# EAGLE design tile (EAGLE 6.1)
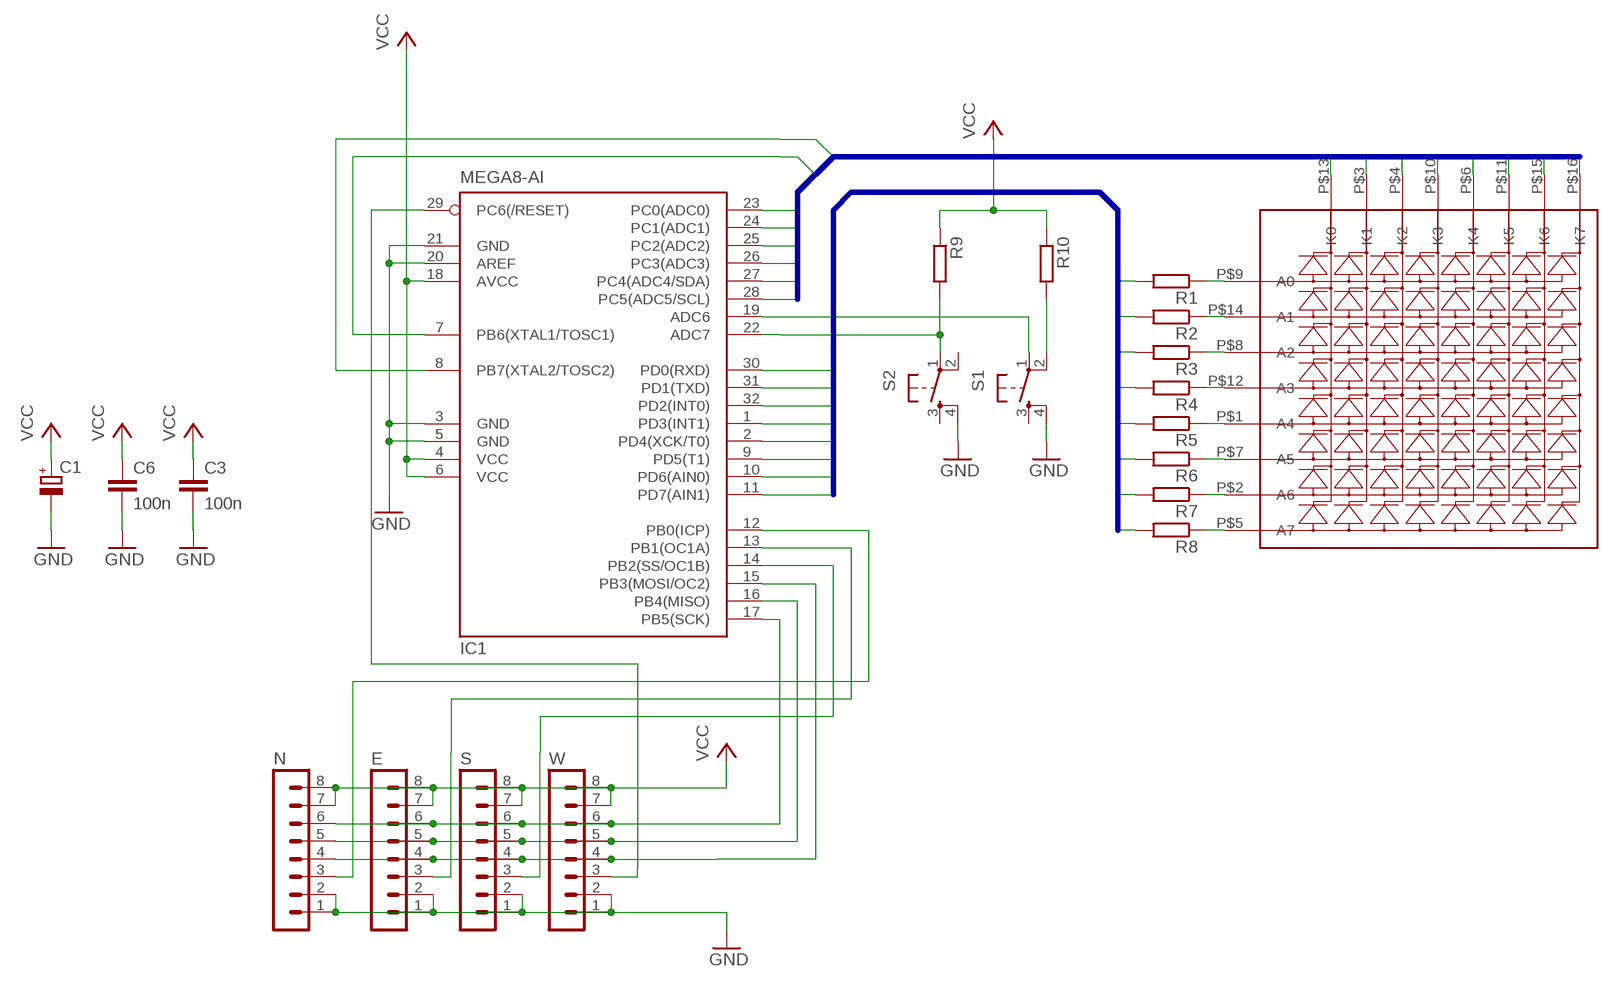
[diagram p0: schematic, sheet 1]

## Parts
C1  CPOL-EUB  [PANASONIC_B]
C3  100n  C-EUC0805  [C0805]
C6  100n  C-EUC0805  [C0805]
E  MA08-1  [MA08-1]
IC1  MEGA8-AI  [TQFP32-08]
N  MA08-1  [MA08-1]
R1  R-EU_M0805  [M0805]
R2  R-EU_M0805  [M0805]
R3  R-EU_M0805  [M0805]
R4  R-EU_M0805  [M0805]
R5  R-EU_M0805  [M0805]
R6  R-EU_M0805  [M0805]
R7  R-EU_M0805  [M0805]
R8  R-EU_M0805  [M0805]
R9  R-EU_M0805  [M0805]
R10  R-EU_M0805  [M0805]
S  MA08-1  [MA08-1]
S1  TAC_SWITCHSMD  [TACTILE_SWITCH_SMD]
S2  TAC_SWITCHSMD  [TACTILE_SWITCH_SMD]
U$1  LED-MATRIX  [LED-MATRIX]
W  MA08-1  [MA08-1]

## Nets
A0: IC1.30(PD0(RXD)) R1.2
A1: IC1.31(PD1(TXD)) R2.2
A2: IC1.32(PD2(INT0)) R3.2
A3: IC1.1(PD3(INT1)) R4.2
A4: IC1.2(PD4(XCK/T0)) R5.2
A5: IC1.9(PD5(T1)) R6.2
A6: IC1.10(PD6(AIN0)) R7.2
A7: IC1.11(PD7(AIN1)) R8.2
GND: C1.- C3.2 C6.2 E.1 E.2 IC1.3(GND) IC1.5(GND) IC1.20(AREF) IC1.21(GND) N.1 N.2 S1.4 S2.4 S.1 S.2 W.1 W.2
K0: IC1.23(PC0(ADC0)) U$1.P$13(K0)
K1: IC1.24(PC1(ADC1)) U$1.P$3(K1)
K2: IC1.25(PC2(ADC2)) U$1.P$4(K2)
K3: IC1.26(PC3(ADC3)) U$1.P$10(K3)
K4: IC1.27(PC4(ADC4/SDA)) U$1.P$6(K4)
K5: IC1.28(PC5(ADC5/SCL)) U$1.P$11(K5)
K6: IC1.7(PB6(XTAL1/TOSC1)) U$1.P$15(K6)
K7: IC1.8(PB7(XTAL2/TOSC2)) U$1.P$16(K7)
N$1: IC1.19(ADC6) S1.1
N$2: IC1.22(ADC7) R9.2 S2.1
N$3: E.4 IC1.15(PB3(MOSI/OC2)) N.4 S.4 W.4
N$4: R10.2 S1.2
N$6: IC1.14(PB2(SS/OC1B)) S.3
N$7: E.6 IC1.17(PB5(SCK)) N.6 S.6 W.6
N$8: IC1.29(PC6(/RESET)) W.3
N$9: E.5 IC1.16(PB4(MISO)) N.5 S.5 W.5
N$10: IC1.12(PB0(ICP)) N.3
N$11: E.3 IC1.13(PB1(OC1A))
NA0: R1.1 U$1.P$9(A0)
NA1: R2.1 U$1.P$14(A1)
NA2: R3.1 U$1.P$8(A2)
NA3: R4.1 U$1.P$12(A3)
NA4: R5.1 U$1.P$1(A4)
NA5: R6.1 U$1.P$7(A5)
NA6: R7.1 U$1.P$2(A6)
NA7: R8.1 U$1.P$5(A7)
VCC: C1.+ C3.1 C6.1 E.7 E.8 IC1.4(VCC) IC1.6(VCC) IC1.18(AVCC) N.7 N.8 R9.1 R10.1 S.7 S.8 W.7 W.8
Unconnected: S1.3 S2.2 S2.3

## Buses
K[0..7]
A[0..7]

## Library data of the parts
C1 = rcl:CPOL-EU: POLARIZED CAPACITOR, European symbol
C3 C6 = rcl:C-EU: CAPACITOR, European symbol
E N S W = tile:MA08-1: PIN HEADER
IC1 = atmel:MEGA8: MICROCONTROLLER 8 Kbytes FLASH, 1 kbytes SRAM, 512 bytes EEPROM, USART, 6-channel 10 bit ADC, 2-channel 8 bit ADC Pin compatible with Atmega48, ATMega88, ATMega168 Source: avr.lbr
R1-R10 = rcl:R-EU_: RESISTOR, European symbol
S1 S2 = SparkFun-Electromechanical:TAC_SWITCH: Momentary Switch Button commonly used for reset or general input. Spark Fun Electronics SKU : COM-00097 SMT- SWCH-08247; PROD_ID: SWCH-08247
U$1 = led-matrix:LED-MATRIX

## Board
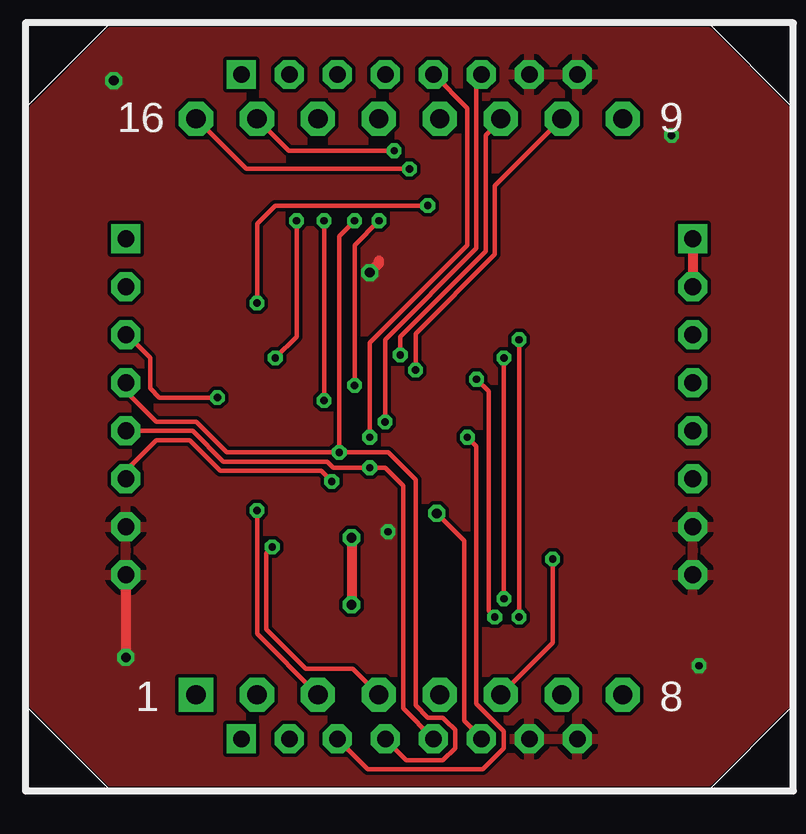
[diagram p1: board, top side]
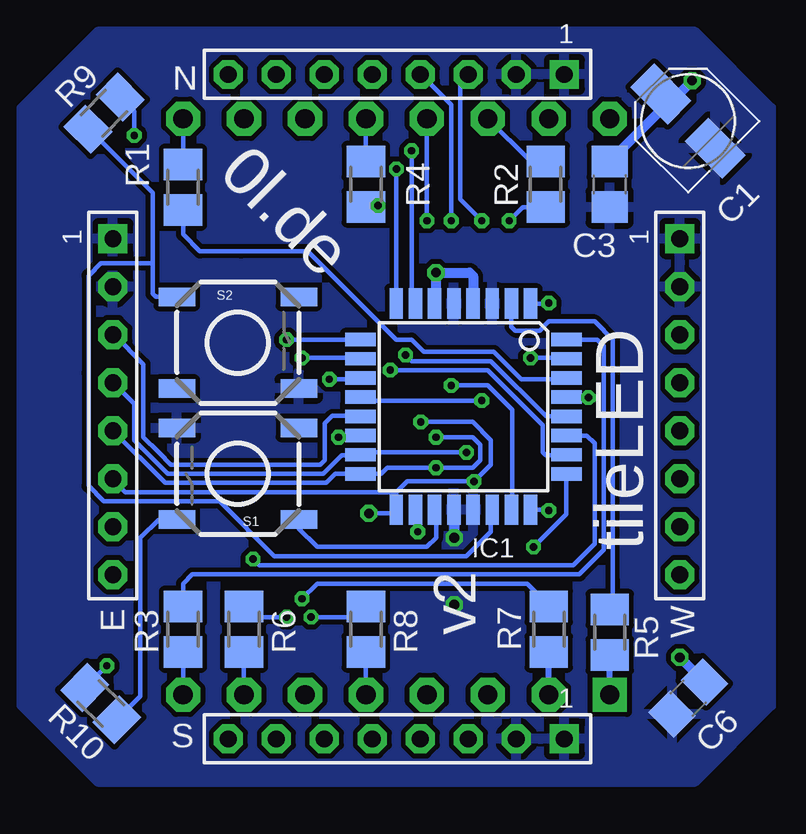
[diagram p2: board, bottom side, seen from below]

No outline drawn. Coordinates in mm, seen from the top.
Copper layers (1*16): Top 0.035mm / dielectric 1.5mm / Bottom 0.035mm
Design rules: minimum track width 6mil, minimum drill 12mil, track to track 6mil, track to pad 6mil, pad to pad 6mil, via to via 6mil, smd to smd 0mil, copper to edge 10mil, drill to drill 10mil, minimum pad ring 10mil, minimum via ring 6mil, stop-mask expansion 2mil, vias tented up to drill 100mil, thermal gap 10mil

### Footprints (pad centres in the part's own frame; a part is rotated, then mirrored left to right if it is on the bottom)
PANASONIC_B = smd 2.2 x 1.4: + 1.6,0; - -1.6,0
C0805 = smd 1.3 x 1.5: 1 -0.95,0; 2 0.95,0
MA08-1 = drill 0.7 square: 1 -7,0 | drill 0.7 octagon: 2 -5,0; 3 -3,0; 4 -1,0; 5 1,0; 6 3,0; 7 5,0; 8 7,0
TQFP32-08 = smd 1.27 x 0.559: 1 -4.293,2.8; 2 -4.293,2; 3 -4.293,1.2; 4 -4.293,0.4; 5 -4.293,-0.4; 6 -4.293,-1.2; 7 -4.293,-2; 8 -4.293,-2.8; 17 4.293,-2.8; 18 4.293,-2; 19 4.293,-1.2; 20 4.293,-0.4; 21 4.293,0.4; 22 4.293,1.2; 23 4.293,2; 24 4.293,2.8 | smd 0.559 x 1.27: 9 -2.8,-4.293; 10 -2,-4.293; 11 -1.2,-4.293; 12 -0.4,-4.293; 13 0.4,-4.293; 14 1.2,-4.293; 15 2,-4.293; 16 2.8,-4.293; 25 2.8,4.293; 26 2,4.293; 27 1.2,4.293; 28 0.4,4.293; 29 -0.4,4.293; 30 -1.2,4.293; 31 -2,4.293; 32 -2.8,4.293
M0805 = smd 1.3 x 1.6: 1 -0.95,0; 2 0.95,0
TACTILE_SWITCH_SMD = smd 1.524 x 0.762: 1 -2.54,1.905; 2 2.54,1.905; 3 -2.54,-1.905; 4 2.54,-1.905
LED-MATRIX = drill 0.8 pad 1.422 square: P$1 7.11,4 | drill 0.8 pad 1.422 octagon: P$2 9.65,4; P$3 12.19,4; P$4 14.73,4; P$5 17.27,4; P$6 19.81,4; P$7 22.35,4; P$8 24.89,4; P$9 24.89,28; P$10 22.35,28; P$11 19.81,28; P$12 17.27,28; P$13 14.73,28; P$14 12.19,28; P$15 9.65,28; P$16 7.11,28

### Placement (x,y rotation side)
C1  3.85,27.9 135 bottom
C3  7.11,25.27 270 bottom
C6  3.84,3.86 225 bottom
E  27.81,16 270 bottom
IC1  13.21,16 270 bottom
N  16,29.84 180 bottom
R1  24.89,25.15 270 bottom
R2  9.78,25.27 270 bottom
R3  24.89,6.73 90 bottom
R4  17.27,25.27 270 bottom
R5  7.11,6.6 90 bottom
R6  22.35,6.73 90 bottom
R7  9.65,6.73 90 bottom
R8  17.27,6.73 90 bottom
R9  28.18,28.23 225 bottom
R10  28.32,3.63 315 bottom
S  16,2.16 180 bottom
S1  22.61,13.21 180 bottom
S2  22.61,18.67 0 bottom
U$1  0,0 0 top
W  4.19,16 270 bottom

### Tracks (layer width: path | path; a pad name or v marks a point on that pad's centre or on a via)
A0
  Bottom 0.178: 8.98,17.14 10.67,17.14 10.79,17.14 11.94,18.29 14.86,18.29 15.37,18.8 16,18.8 19.68,22.48 19.81,22.48 22.48,22.48 24.19,22.48 24.89,23.18 24.89,24.13 | 24.89,24.13 R1.2 | R1.2 24.89,24.26 | 24.89,24.13 R1.2
  Bottom 0.254: 24.83,24.13 R1.2 | 8.98,17.14 IC1.30
A1  (via drill 0.3)
  Top 0.178: v10.41,18.03 11.3,18.92 v11.3,23.75
  Bottom 0.178: IC1.31 9.02,18.03 v10.41,18.03 | v11.3,23.75 10.73,24.32 R2.2
A2
  Bottom 0.178: R3.2 24.89,8.64 24.51,9.02 8.38,9.02 7.37,10.03 7.37,18.54 7.63,18.8 IC1.32
  Bottom 0.254: IC1.32
A3  (via drill 0.3)
  Top 0.178: v9.65,20.32 9.65,23.62 10.41,24.38 14.48,24.38 v16.76,24.38
  Bottom 0.178: IC1.1 9.68,20.3 v9.65,20.32 | v16.76,24.38 R4.2
A4
  Bottom 0.178: 6.99,7.68 6.99,8.76 6.99,16.51 6.99,18.8 7.75,19.56 9.65,19.56 10.03,19.18 11.05,19.18 11.21,19.34 IC1.2
  Bottom 0.254: 6.99,7.68 R5.2 | 11.18,20.26 IC1.2 11.18,20.33
A5  (via drill 0.3)
  Top 0.178: v20.57,18.8 v20.57,7.24
  Bottom 0.178: v20.57,7.24 22.29,7.24 | IC1.9 v20.57,18.8
  Bottom 0.254: 22.29,7.24 R6.2
A6  (via drill 0.3)
  Top 0.178: v19.94,18.03 v19.94,8
  Bottom 0.178: v19.94,8 19.3,8.64 10.54,8.64 9.65,7.75 R7.2 | IC1.10 17.53,18.03 v19.94,18.03
A7  (via drill 0.3)
  Top 0.178: v18.8,17.14 19.3,16.64 19.3,7.49 v19.56,7.24
  Bottom 0.178: v19.56,7.24 17.27,7.24 | 17.68,17.14 18.29,17.14 v18.8,17.14
  Bottom 0.254: IC1.11 17.68,17.14 | 17.27,7.24 R8.2
GND  (via drill 0.41)
  Top 0.406: v13.59,10.54 v13.59,7.75 | E.1 E.2
  Bottom 0.406: IC1.20 13.59,11.68 v13.59,10.54 | E.2 27.81,20.95 E.2
  pour Bottom (isolate 0.203): 0.38,28.45 3.56,31.62 28.45,31.62 31.62,28.45 31.62,3.56 28.45,0.38 3.56,0.38 0.38,3.56
K0  (via drill 0.3)
  Top 0.178: v13.72,16.89 13.72,17.27 13.72,22.73 v14.73,23.75
  Bottom 0.178: 11.18,11.74 11.18,15.88 12.19,16.89 v13.72,16.89 | U$1.P$13 14.73,27.94 14.73,27.43 v14.73,23.75
  Bottom 0.254: 11.18,11.74 IC1.23
K1  (via drill 0.3)
  Top 0.178: v9.65,11.68 9.65,6.54 U$1.P$3
  Bottom 0.178: IC1.24 9.68,11.71 v9.65,11.68
K2  (via drill 0.3)
  Top 0.178: v10.29,10.16 10.03,9.91 10.03,6.73 11.68,5.08 13.65,5.08 U$1.P$4
  Bottom 0.178: IC1.25 8.91,11.53 v10.29,10.16
K3  (via drill 0.3)
  Top 0.178: v16.26,17.53 16.26,19.05 19.56,22.35 19.56,25.21 U$1.P$10
  Bottom 0.178: 9.01,13.97 9.78,13.97 9.91,14.1 9.91,15.24 12.19,17.53 v16.26,17.53
  Bottom 0.254: IC1.26 9.01,13.97
K4  (via drill 0.3)
  Top 0.178: v21.97,9.65 21.97,6.16 U$1.P$6
  Bottom 0.178: IC1.27 8.07,14.8 7.75,14.48 7.75,10.29 8.64,9.4 21.72,9.4 v21.97,9.65
K5  (via drill 0.3)
  Top 0.178: U$1.P$11 19.81,27.94 19.18,27.3 19.18,26.04 19.18,24.26 19.18,22.48 15.62,18.92 v15.62,18.16
  Bottom 0.178: v15.62,18.16 15.37,17.91 12.06,17.91 9.76,15.6 IC1.28
K6  (via drill 0.3)
  Top 0.178: U$1.P$15 10.98,26.67 v15.37,26.67
  Bottom 0.178: v15.37,26.67 15.37,20.33
  Bottom 0.254: 15.37,20.33 IC1.7
K7  (via drill 0.3)
  Top 0.178: U$1.P$16 9.2,25.91 v16,25.91
  Bottom 0.178: IC1.8 16,21.97 v16,25.91
  Bottom 0.254: IC1.8
N$1
  Bottom 0.178: IC1.19 14.35,11.65 14.35,10.54 14.73,10.16 19.3,10.16 20.07,10.92 S1.1
N$2
  Bottom 0.178: S2.1 26.04,20.57 26.16,20.7 26.16,21.97 | 26.16,21.97 26.16,24.91 28.81,27.56 R9.2 | 26.16,21.97 28.32,21.97 28.83,21.46 28.83,17.4 28.83,12.7 28.19,12.06 23.37,12.06 21.08,9.78 13.08,9.78 12.06,10.79 12.06,11.65 IC1.22
N$3  (via drill 0.3)
  Top 0.178: v13.72,23.75 13.08,23.11 13.08,14.35 v13.08,14.1 | W.4 4.19,16.64 5.46,15.37 7.11,15.37 8.38,14.1 12.57,14.1 v13.08,14.1 | S.4 15,2.17 15,2.14 15.75,1.4 15.88,1.27 17.4,1.27 17.91,1.78 17.91,2.54 17.53,2.92 17.4,3.05 16.76,3.05 16.26,3.56 16.26,10.92 16.26,12.95 15.11,14.1 v13.08,14.1
  Bottom 0.178: v13.72,23.75 13.72,28.57 14.99,29.84 N.4 | v13.08,14.1 17.47,14.1 IC1.15 17.53,13.97 18.29,13.97 19.05,13.21 25.53,13.21 26.04,13.72 26.92,14.61 26.92,16.13 27.8,17 E.4
N$4
  Bottom 0.178: S1.2 25.91,11.3 26.67,10.54 26.67,3.94 27.69,2.92 R10.2
N$6  (via drill 0.3)
  Top 0.178: v18.41,14.73 18.8,14.35 18.8,3.62 19.94,2.48 19.94,1.78 19.05,0.89 14.27,0.89 S.3
  Bottom 0.178: IC1.14 17.57,14.73 v18.41,14.73
N$7  (via drill 0.3, 0.41)
  Top 0.178: W.6 4.19,13.34 5.46,14.61 6.86,14.61 8.13,13.34 12.32,13.34 v12.76,12.89 | N.6 18.8,29.64 18.8,25.91 18.8,24.13 18.8,22.61 14.99,18.8 v14.99,15.37 | S.6 19,2.21 18.54,2.67 18.29,2.92 18.29,10.29 18.29,10.41 v17.14,11.56
  Bottom 0.178: IC1.17 | IC1.17 16,11.68 | 16,12.45 15.56,12.89 v12.76,12.89 12.06,13.59 12.06,14.61 12.83,15.37 v14.99,15.37 | IC1.17 16,11.81 16,12.06 16,12.45 | IC1.17 | 16.01,12.44 16,12.45 | 16,12.45 18.29,12.45 27.3,12.45 27.81,12.95 E.6 | IC1.17 16.16,11.56 16.89,11.56 v17.14,11.56
N$8  (via drill 0.3)
  Top 0.178: W.3 4.24,19 5.21,18.03 5.21,16.76 5.59,16.38 v8,16.38
  Bottom 0.178: v8,16.38 8.9,16.38 IC1.29
N$9  (via drill 0.3)
  Top 0.178: W.5 6.97,15 8.26,13.72 12.57,13.72 12.83,13.46 v14.35,13.46 14.99,13.46 15.75,12.7 15.75,10.29 15.75,3.43 17,2.17 S.5 | v14.35,14.73 14.35,18.67 18.41,22.73 18.41,24 18.41,25.78 18.41,28.45 17.02,29.84 N.5
  Bottom 0.178: E.5 25.64,12.83 18.92,12.83 18.55,13.2 IC1.16 16.64,13.2 16.38,13.46 v14.35,13.46 12.83,13.46 12.7,13.59 12.51,13.78 12.51,14.41 12.83,14.73 v14.35,14.73
N$10  (via drill 0.3)
  Top 0.178: v12.45,23.75 v12.45,16.26
  Bottom 0.178: N.3 13.34,29.51 13.34,24.64 v12.45,23.75 | 17.48,16.38 IC1.12 17.36,16.26 v12.45,16.26
N$11
  Bottom 0.178: IC1.13 17.52,15.62 18.67,15.62 18.92,15.37 18.99,15.3 18.99,13.78 19.18,13.59 25.4,13.59 25.91,14.1 26.54,14.73 26.54,17.78 27.77,19 | 27.77,19 27.81,19.05 | 27.77,19 E.3
NA0
  Bottom 0.178: R1.1 U$1.P$9
NA1
  Bottom 0.178: U$1.P$14 10.41,26.22 R2.1
NA2
  Bottom 0.178: R3.1 U$1.P$8
  Bottom 0.254: U$1.P$8
NA3
  Bottom 0.178: U$1.P$12 17.27,26.29 R4.1
NA4
  Bottom 0.254: U$1.P$1 R5.1
NA5
  Bottom 0.178: R6.1 U$1.P$7
  Bottom 0.254: U$1.P$7
NA6
  Bottom 0.254: U$1.P$2 R7.1
NA7
  Bottom 0.178: U$1.P$5 R8.1
  Bottom 0.254: R8.1
VCC  (via drill 0.3, 0.41)
  Top 0.406: W.8 v4.19,5.56 | v14.35,21.59 14.73,21.97 14.73,22.1
  Bottom 0.178: IC1.18 15.24,11.68 v15.11,10.79 | R9.1 26.92,28.32 v26.92,27.3 | v28.07,5.21 28.97,4.3 R10.1
  Bottom 0.406: C1.+ 4.98,28.36 C3.1 4.63,28.7 4.57,28.7 v3.68,29.59 | v4.19,5.56 C6.1 | 14.35,20.35 IC1.6 14.35,20.35 | 14.35,20.35 14.35,21.46 14.22,21.59 12.95,21.59 12.81,21.44 IC1.4 | 14.35,20.35 v14.35,21.59
  pour Top: 0.38,28.45 3.56,31.62 28.45,31.62 31.62,28.45 31.62,3.56 28.45,0.38 3.56,0.38 0.38,3.56

### Text on the board
bPlace: 0l.de | tileLED | v2